# EasyEDA schematic Schematics.json
TITLE: Sheet_1; REV: 1.0; Date: 2026-01-22; Sheet: 1/1; Drawn By: itsmohammadsarfaraz; Company: HackClub
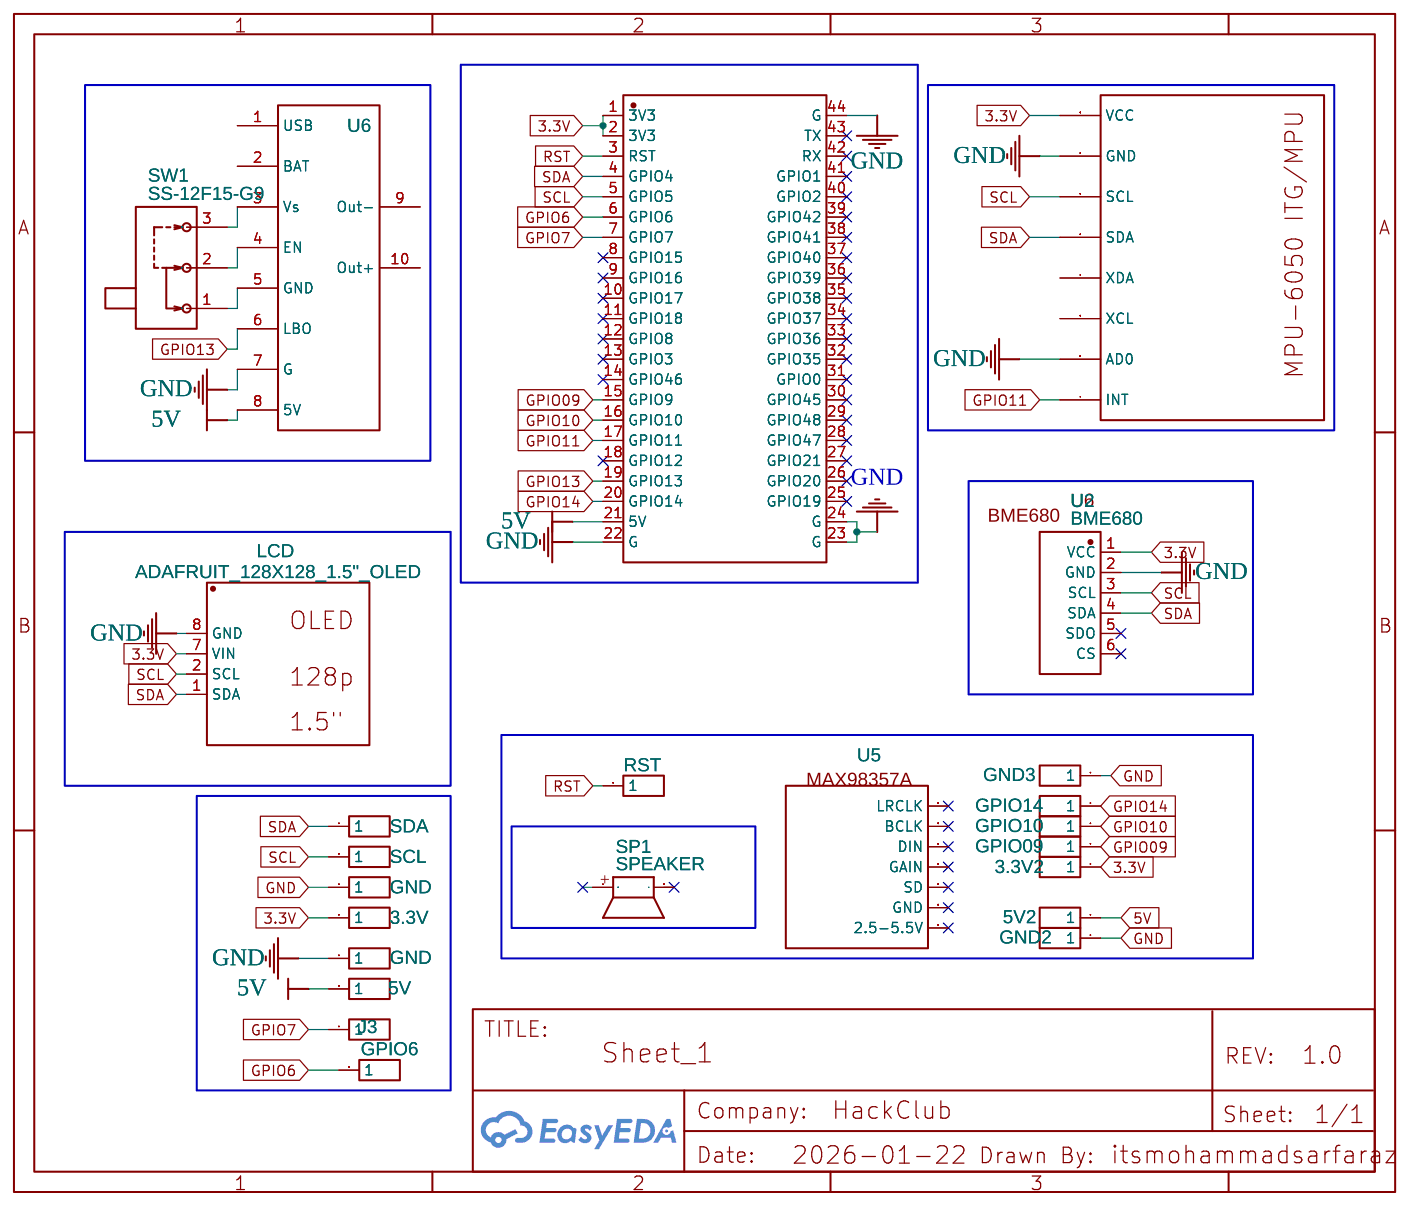
[diagram p0: schematic sheet]

## Parts
3.3V  HDR-M-2.54_1x1  [HDR-M-2.54_1X1]
3.3V2  HDR-M-2.54_1x1  [HDR-M-2.54_1X1]
5V2  HDR-M-2.54_1x1  [HDR-M-2.54_1X1]
GND  HDR-M-2.54_1x1  [HDR-M-2.54_1X1]
GND2  HDR-M-2.54_1x1  [HDR-M-2.54_1X1]
GND3  HDR-M-2.54_1x1  [HDR-M-2.54_1X1]
GPIO09  HDR-M-2.54_1x1  [HDR-M-2.54_1X1]
GPIO10  HDR-M-2.54_1x1  [HDR-M-2.54_1X1]
GPIO14  HDR-M-2.54_1x1  [HDR-M-2.54_1X1]
J1  GND  [HDR-M-2.54_1X1]
J2  5V  [HDR-M-2.54_1X1]
J3  HDR-M-2.54_1x1  [HDR-M-2.54_1X1]
J5  GPIO6  [HDR-M-2.54_1X1]
LCD  ADAFRUIT_128X128_1.5"_OLED  [ADAFRUIT_128X128_OLED]
RST  HDR-M-2.54_1x1  [HDR-M-2.54_1X1]
SCL  HDR-M-2.54_1x1  [HDR-M-2.54_1X1]
SDA  HDR-M-2.54_1x1  [HDR-M-2.54_1X1]
SP1  SPEAKER  [SPEAKER]
SW1  SS-12F15-G9  [SW-TH_SS-12F15-G4_C52129312]
U1  MPU-6050 ITG/MPU  [MPU6050 ITG/MPU]
U2  BME680  [BME680]
U4  ESP32-S3-DevKitM-1U-N8  [ESP32-S3-DEVKITC-1-N8R8]
U5  I2S MAX98357A MODULE  [MAX98357A]
U6  Adafruit Powerboost 1000C footprint  [ADAFRUIT POWER BOOST 1000C]

## Library data of the parts
3.3V 3.3V2 5V2 GND GND2 GND3 GPIO09 GPIO10 GPIO14 J1-J3 J5 RST SCL SDA = HDR-M-2.54_1x1: Supplier Part: C81276; Supplier: LCSC; Contributor: LCEDA_Lib
LCD = ADAFRUIT_128X128_1.5"_OLED: Manufacturer Part: MSP1503; Contributor: Derick2k
SP1 = SPEAKER: Código: PK-12N40PEQ; Fabricante: Unicoba&Mallory; Encapsulamento: *; Identificação: *; Observação: *; Código Estoque: 010332; Preço 1KPC: *; Preço 1PC: *; Contributor: doomscar
SW1 = SS-12F15-G9: Supplier: LCSC; Supplier Part: C52129317; Manufacturer: DEALON(德艺隆); Contributor: lcsc; JLCPCB Part Class: Extended Part
U1 = MPU-6050 ITG/MPU: Contributor: boutlanesimo1
U2 = BME680: Supplier: RS-Online; Contributor: dwipanjan
U4 = ESP32-S3-DevKitM-1U-N8: Manufacturer: Espressif; Manufacturer Part: ESP32-S3-DevKitM-1; Supplier: Mouser; Supplier Part: 356-ESP32S3DKITM1UN8; link: https://docs.espressif.com/projects/esp-dev-kits/en/latest/esp32s3/esp32-s3-devkitc-1/index.html; Contributor: Guest
U5 = I2S MAX98357A MODULE: Manufacturer: Adafruit; Manufacturer Part: 3006; Supplier Part: 3006; link: https://www.adafruit.com/product/3006; Contributor: off112
U6 = Adafruit Powerboost 1000C footprint: Manufacturer: Adafruit; Manufacturer Part: ada2465; Supplier: Adafruit; Supplier Part: ada2465; link: https://www.adafruit.com/product/2465; Contributor: meumdav

## Nets
3.3V: 3.3V.1 3.3V2.1 LCD.7(VIN) U1.0(VCC) U2.1(VCC) U4.1(3V3) U4.2(3V3)
5V: 5V2.1 J2.1 U4.21(5V) U6.8(5V)
GND: GND.1 GND2.1 GND3.1 J1.1 LCD.8(GND) U1.1(GND) U1.6(AD0) U2.2(GND) U4.22(G) U4.23(G) U4.24(G) U4.44(G) U6.7(G)
GPIO6: J3.1 U4.6(GPIO6)
GPIO7: J5.1 U4.7(GPIO7)
GPIO09: GPIO09.1 U4.15(GPIO9)
GPIO10: GPIO10.1 U4.16(GPIO10)
GPIO11: U1.7(INT) U4.17(GPIO11)
GPIO13: U4.19(GPIO13) U6.6(LBO)
GPIO14: GPIO14.1 U4.20(GPIO14)
RST: RST.1 U4.3(RST)
SCL: LCD.2(SCL) SCL.1 U1.2(SCL) U2.3(SCL) U4.5(GPIO5)
SDA: LCD.1(SDA) SDA.1 U1.3(SDA) U2.4(SDA) U4.4(GPIO4)
Net-(SW1-1): SW1.1 U6.5(GND)
Net-(SW1-2): SW1.2 U6.4(EN)
Net-(SW1-3): SW1.3 U6.3(Vs)

Not connected (* = marked no-connect by the designer): SP1 1(+) 2(-)*; U1 4(XDA) 5(XCL); U2 5(SDO)* 6(CS)*; U4 8(GPIO15)* 9(GPIO16)* 10(GPIO17)* 11(GPIO18)* 12(GPIO8)* 13(GPIO3)* 14(GPIO46)* 18(GPIO12)* 25(GPIO19)* 26(GPIO20)* 27(GPIO21)* 28(GPIO47)* 29(GPIO48)* 30(GPIO45)* 31(GPIO0)* 32(GPIO35)* 33(GPIO36)* 34(GPIO37)* 35(GPIO38)* 36(GPIO39)* 37(GPIO40)* 38(GPIO41)* 39(GPIO42)* 40(GPIO2)* 41(GPIO1)* 42(RX)* 43(TX)*; U5 H1(LRCLK)* H2(BCLK)* H3(DIN)* H4(GAIN)* H5(SD)* H6(GND)* H7(2.5-5.5V)*; U6 1(USB) 2(BAT) 9(Out-) 10(Out+)
